# Altium schematic sheet PowerSource.SchDoc
size A4
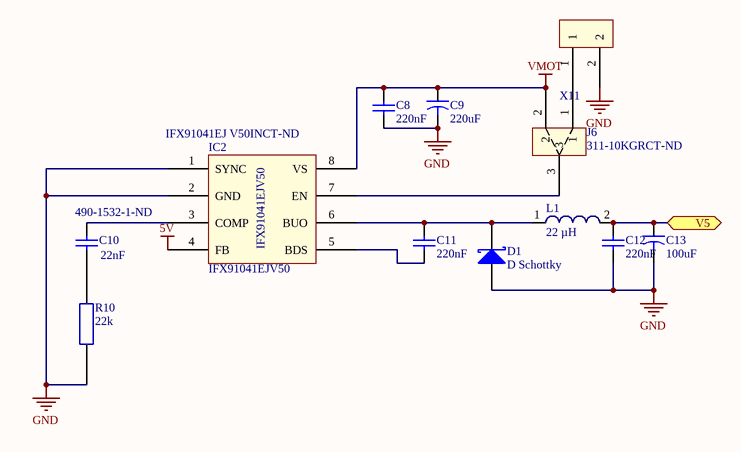
[diagram p0: PowerSource.SchDoc]

## Parts
C8  value 220nF  [Res 0603]  (hidden comment: Cap)
C9  value 220uF  [CAPR5-4X5]  (hidden comment: Cap2)
C10  value 22nF  Supplier Part Number 1: 490-1532-1-ND  [Res 0603]  (hidden comment: Cap)
C11  value 220nF  [Res 0603]  (hidden comment: Cap)
C12  value 220nF  [Res 0603]  (hidden comment: Cap)
C13  value 100uF  [CAPR5-4X5]  (hidden comment: Cap2)
D1  D Schottky  [SMB]
IC2  IFX91041EJV50  Supplier Part Number 1: IFX91041EJ V50INCT-ND  [IFX91041EJV50]
J6  Supplier Part Number 1: 311-10KGRCT-ND  [VCC to GND Jumper]  (hidden comment: VCC to GND Jumper)
L1  22 µH  [WE-PD 7345 Plastic Base]
R10  22k  [Res 0603]
X11  2p Connector  [2p 2.54 pitch]  (value not drawn)

## Ports
V5

## Nets
5V: IC2.4(FB)
GND: C8.1 C9.2 C12.1 C13.2 D1.1(A) IC2.1(SYNC) IC2.2(GND) R10.1 X11.2
VMOT: C8.2 C9.1 IC2.8(VS) J6.2
V5: C12.2 C13.1 L1.2 ; port V5
NetC10_1: C10.1 R10.2
NetC10_2: C10.2 IC2.3(COMP)
NetC11_1: C11.1 IC2.5(BDS)
NetC11_2: C11.2 D1.2(K) IC2.6(BUO) L1.1
NetIC2_7: IC2.7(EN) J6.3
NetJ6_1: J6.1 X11.1

## Library data of the parts
C8 C10-C12 = Cap: Capacitor; Published: 8-Jun-2000; LatestRevisionDate: 17-Jul-2002; LatestRevisionNote: Re-released for DXP Platform.; PackageReference: RAD-0.3; Publisher: Altium Limited; PackageDescription: Radial Cap, Thru-Hole; 2 Leads; 0.3 in Pin Spacing
  C10: Supplier 1: Digi-Key
C9 C13 = Cap2: Capacitor; Published: 23-Sep-2002; PackageReference: CAPR5-4X5; Publisher: Altium Limited; PackageDescription: Capacitor; 2 Leads
D1 = D Schottky: Schottky Diode; Published: 8-Jun-2000; LatestRevisionDate: 17-Jul-2002; LatestRevisionNote: Re-released for DXP Platform.; PackageReference: SMB; Publisher: Altium Limited; PackageDescription: DO-214-AA/SMB; 2 C-Bend Leads; Body 5.3 x 3.6 mm, inc. leads (LxW); Code_JEDEC: DO-214-AA
L1 = WE-PD 7345, M Plastic Base, 7447779122: SMD-Shielded Power Inductor WE-PD, L=22 µH; Manufacturer: Würth Elektronik eiSos GmbH; partNo: 7447779122; Inductance: 22 µH; ComponentLink1Description: Manufacturer; ComponentLink1URL: http://www.we-online.de; Created by: Christin Zierenner; Created Date: August 2009; ComponentLink2Description: Datasheet; ComponentLink2URL: http://www.we-online.de/katalog/media/pdf/7447779122.pdf
R10 = Res: Value: 22k
IC2 = IFX91041EJV50: Supplier 1: Digi-Key
J6 = VCC to GND Jumper: Supplier 1: Digi-Key